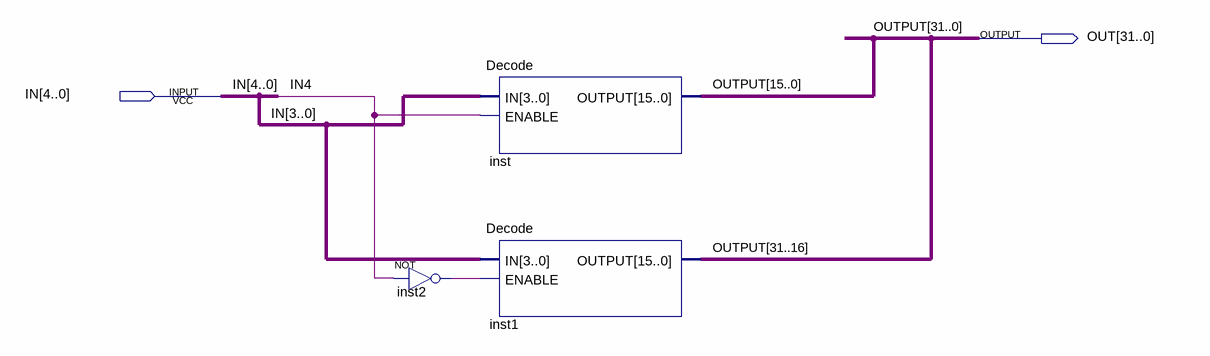
[diagram p0: schematic sheet]
// Quartus schematic DECODE-32BIT.bdf as structural Verilog: 3 symbols, 2 pins
module \DECODE-32BIT  (
  input  [4:0] IN,
  output [31:0] OUT
);

  wire inst2_out;

  not inst2 (inst2_out, IN[4]);
  Decode inst (.IN(IN[3:0]), .ENABLE(IN[4]), .OUTPUT(OUT[15:0]));
  Decode inst1 (.IN(IN[3:0]), .ENABLE(inst2_out), .OUTPUT(OUT[31:16]));

  // Other names for the same wires on the sheet: OUTPUT[31:0] = OUT
endmodule
